# EAGLE design LESR_MainBoard (EAGLE 9.5.2)
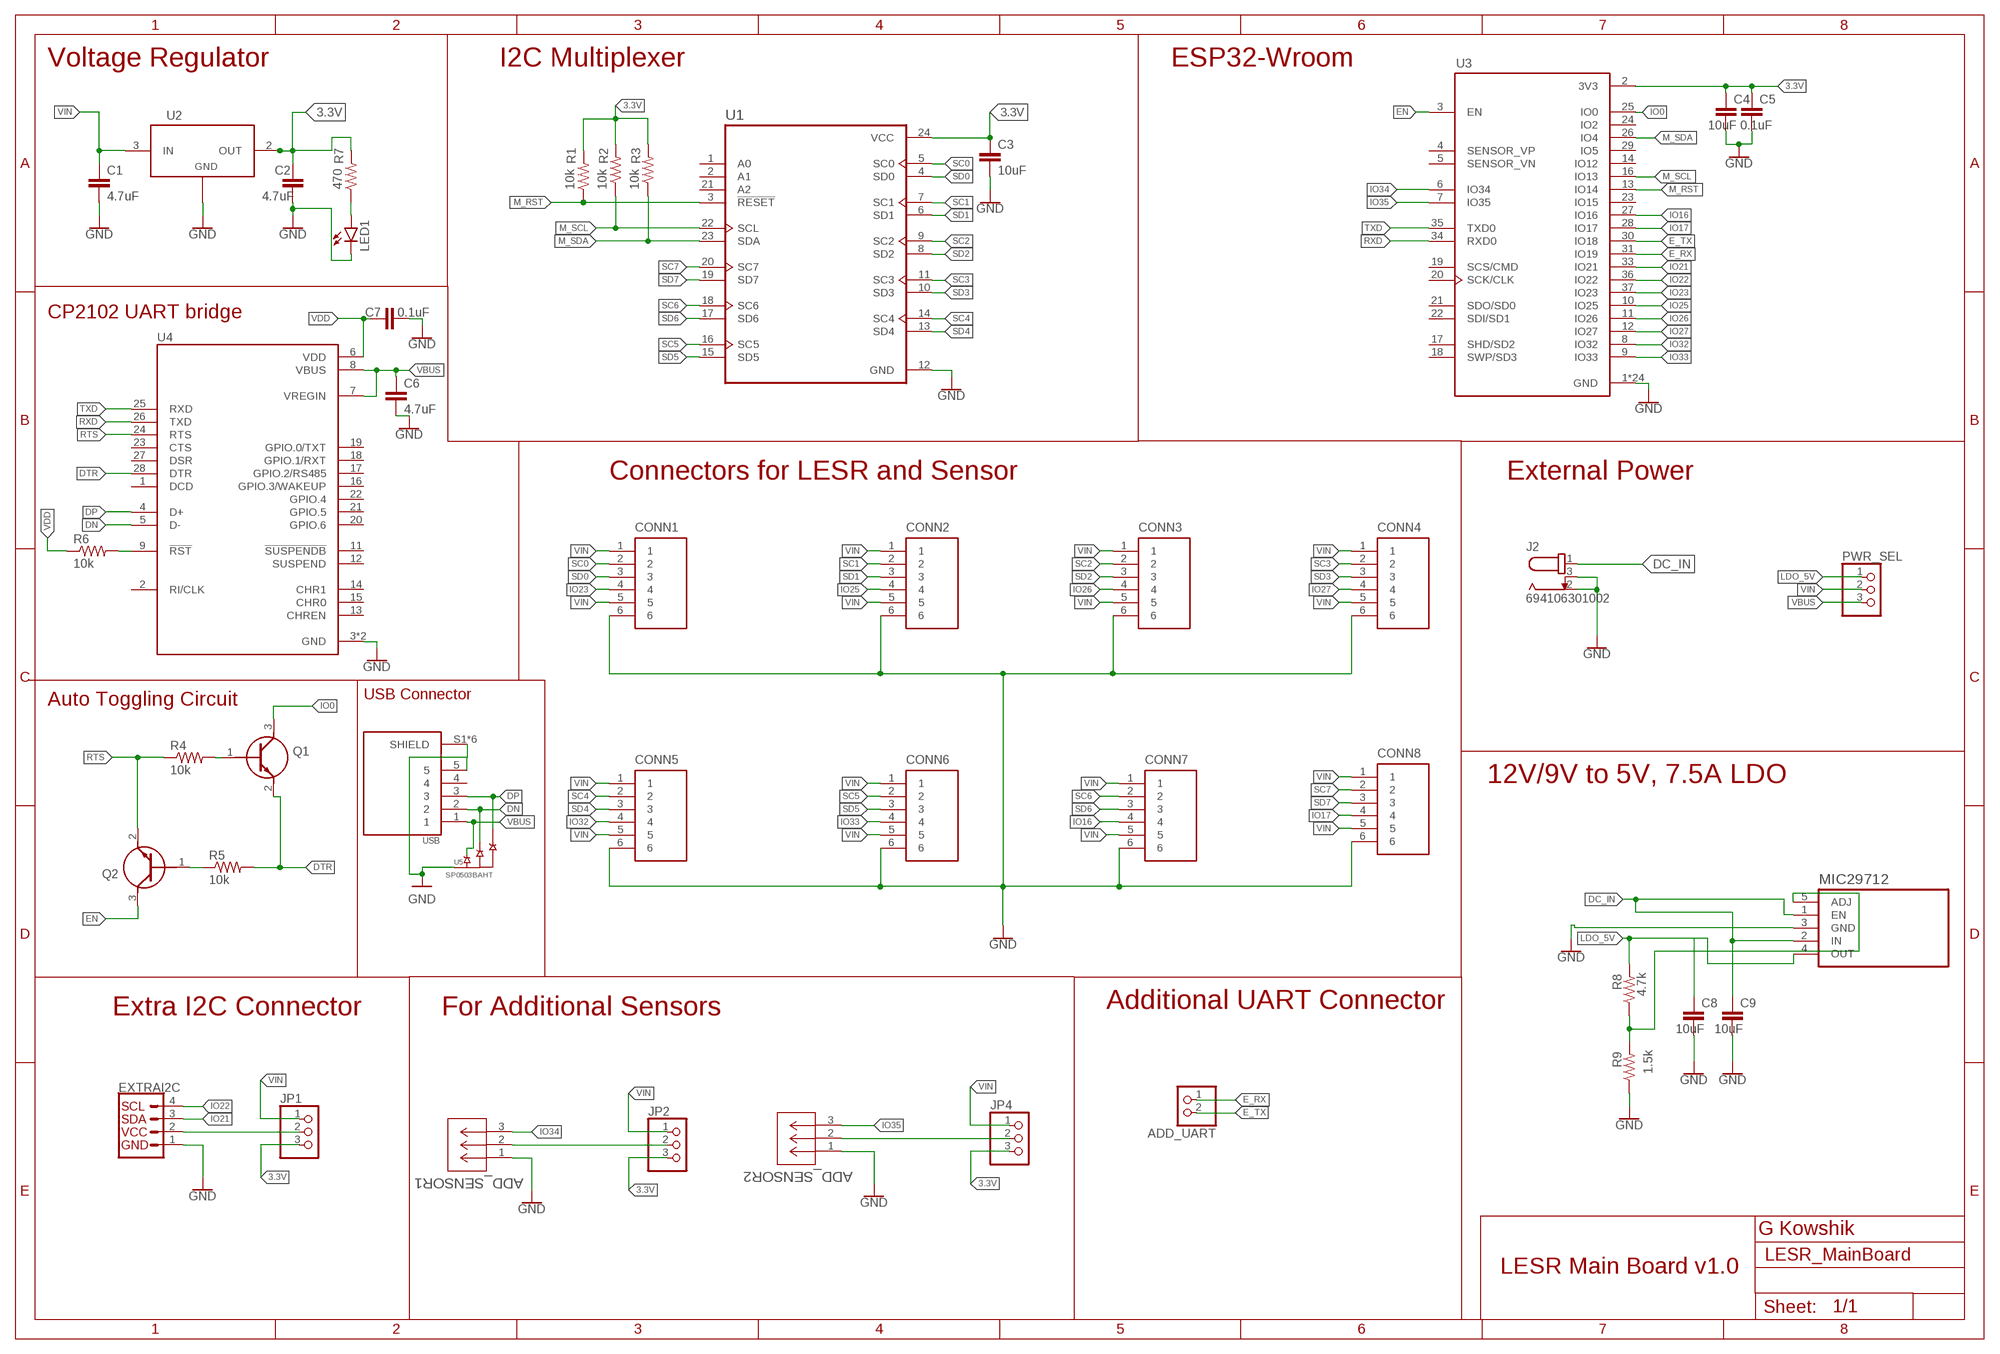
[diagram p0: schematic, sheet 1]

## Parts
ADD_SENSOR1  BM03B-SRSS-TB(LF)(SN)  [CONN_BM03B-SRSS-TB(LF)(SN)_JST]
ADD_SENSOR2  BM03B-SRSS-TB(LF)(SN)  [CONN_BM03B-SRSS-TB(LF)(SN)_JST]
ADD_UART  JST_2PIN-SMT  [JST-PH-2-SMT]
C1  4.7uF  C-EUC0805  [C0805]
C2  4.7uF  C-EUC0805  [C0805]
C3  10uF  C-EUC0805  [C0805]
C4  10uF  C-EUC0805  [C0805]
C5  0.1uF  C-EUC0805  [C0805]
C6  4.7uF  C-EUC0805  [C0805]
C7  0.1uF  C-EUC0805  [C0805]
C8  10uF  C-EUC0805  [C0805]
C9  10uF  C-EUC0805  [C0805]
CONN1  JST_6_PIN_VERTICAL  [JST-6-SMD-VERT-1.0MM]
CONN2  JST_6_PIN_VERTICAL  [JST-6-SMD-VERT-1.0MM]
CONN3  JST_6_PIN_VERTICAL  [JST-6-SMD-VERT-1.0MM]
CONN4  JST_6_PIN_VERTICAL  [JST-6-SMD-VERT-1.0MM]
CONN5  JST_6_PIN_VERTICAL  [JST-6-SMD-VERT-1.0MM]
CONN6  JST_6_PIN_VERTICAL  [JST-6-SMD-VERT-1.0MM]
CONN7  JST_6_PIN_VERTICAL  [JST-6-SMD-VERT-1.0MM]
CONN8  JST_6_PIN_VERTICAL  [JST-6-SMD-VERT-1.0MM]
EXTRAI2C  Vertical Qwiic Connector  QWIIC_CONNECTOR  [JST04_1MM_VERT]
J2  694106301002  [694106301002]
JP1  PINHD-1X3  [1X03]
JP2  PINHD-1X3  [1X03]
JP4  PINHD-1X3  [1X03]
LED1  LEDCHIPLED_0805  [CHIPLED_0805]
MIC29712  MIC29712WT  [TO170P1066X482X1572-5]
PWR_SEL  PINHD-1X3  [1X03]
Q1  SS8050-G  [SOT95P240X115-3N]
Q2  SS8050-G  [SOT95P240X115-3N]
R1  10k  R-US_R0805  [R0805]
R2  10k  R-US_R0805  [R0805]
R3  10k  R-US_R0805  [R0805]
R4  10k  R-US_R0805  [R0805]
R5  10k  R-US_R0805  [R0805]
R6  10k  R-US_R0805  [R0805]
R7  470  R-US_R0805  [R0805]
R8  4.7k  R-US_R0805  [R0805]
R9  1.5k  R-US_R0805  [R0805]
U1  TCA9548APWR  [SOP65P640X120-24N]
U2  NCP1117ST33T3G  [SOT-223]
U3  ESP32-WROOM-32  [MODULE_ESP32-WROOM-32]
U4  CP2102N-A01-GQFN28  [QFN50P500X500X80-29N]
U5  SP0503BAHT  [SOT143]
USB  10118194-0001LF  [AMPHENOL_10118194-0001LF]

## Nets
3.3V: C2.1 C3.1 C4.1 C5.1 JP1.3 JP2.3 JP4.3 R1.2 R2.2 R3.2 R7.2 U1.24(VCC) U2.2(OUT) U2.4 U3.2(3V3)
DC_IN: C9.1 J2.1 MIC29712.1(EN) MIC29712.2(IN)
DN: U4.5(D-) U5.3(B) USB.2
DP: U4.4(D+) U5.4(C) USB.3
DTR: Q1.2(E) R5.2 U4.28(DTR)
E_RX: ADD_UART.1 U3.31(IO19)
E_TX: ADD_UART.2 U3.30(IO18)
EN: Q2.3(C) U3.3(EN)
GND: ADD_SENSOR1.1 ADD_SENSOR2.1 C1.2 C2.2 C3.2 C4.2 C5.2 C6.2 C7.2 C8.2 C9.2 CONN1.6 CONN2.6 CONN3.6 CONN4.6 CONN5.6 CONN6.6 CONN7.6 CONN8.6 EXTRAI2C.1 J2.2 J2.3 LED1.C MIC29712.3(GND) R9.1 U1.12(GND) U2.1(ADJ/GND) U3.1(GND) U3.15(GND) U3.38(GND) U3.39_1(GND) U3.39_2(GND) U3.39_3(GND) U3.39_4(GND) U3.39_5(GND) U3.39_6(GND) U3.39_7(GND) U3.39_8(GND) U3.39_9(GND) U3.39_10(GND) U3.39_11(GND) U3.39_12(GND) U3.39_13(GND) U3.39_14(GND) U3.39_15(GND) U3.39_16(GND) U3.39_17(GND) U3.39_18(GND) U3.39_19(GND) U3.39_20(GND) U3.39_21(GND) U4.3(GND) U4.29(GND) U5.1(GND) USB.5 USB.S1(SHIELD) USB.S2(SHIELD) USB.S3(SHIELD) USB.S4(SHIELD) USB.S5(SHIELD) USB.S6(SHIELD)
IO0: Q1.3(C) U3.25(IO0)
IO16: CONN7.4 U3.27(IO16)
IO17: CONN8.4 U3.28(IO17)
IO21: EXTRAI2C.3 U3.33(IO21)
IO22: EXTRAI2C.4 U3.36(IO22)
IO23: CONN1.4 U3.37(IO23)
IO25: CONN2.4 U3.10(IO25)
IO26: CONN3.4 U3.11(IO26)
IO27: CONN4.4 U3.12(IO27)
IO32: CONN5.4 U3.8(IO32)
IO33: CONN6.4 U3.9(IO33)
IO34: ADD_SENSOR1.3 U3.6(IO34)
IO35: ADD_SENSOR2.3 U3.7(IO35)
LDO_5V: C8.1 MIC29712.4(OUT) PWR_SEL.1 R8.2
M_RST: R1.1 U1.3(!RESET) U3.13(IO14)
M_SCL: R2.1 U1.22(SCL) U3.16(IO13)
M_SDA: R3.1 U1.23(SDA) U3.26(IO4)
N$1: ADD_SENSOR1.2 JP2.2
N$2: MIC29712.5(ADJ) R8.1 R9.2
N$3: Q1.1(B) R4.2
N$4: Q2.1(B) R5.1
N$5: ADD_SENSOR2.2 JP4.2
N$6: R6.2 U4.9(!RST)
N$7: EXTRAI2C.2 JP1.2
N$8: LED1.A R7.1
RTS: Q2.2(E) R4.1 U4.24(RTS)
RXD: U3.34(RXD0) U4.26(TXD)
SC0: CONN1.2 U1.5(SC0)
SC1: CONN2.2 U1.7(SC1)
SC2: CONN3.2 U1.9(SC2)
SC3: CONN4.2 U1.11(SC3)
SC4: CONN5.2 U1.14(SC4)
SC5: CONN6.2 U1.16(SC5)
SC6: CONN7.2 U1.18(SC6)
SC7: CONN8.2 U1.20(SC7)
SD0: CONN1.3 U1.4(SD0)
SD1: CONN2.3 U1.6(SD1)
SD2: CONN3.3 U1.8(SD2)
SD3: CONN4.3 U1.10(SD3)
SD4: CONN5.3 U1.13(SD4)
SD5: CONN6.3 U1.15(SD5)
SD6: CONN7.3 U1.17(SD6)
SD7: CONN8.3 U1.19(SD7)
TXD: U3.35(TXD0) U4.25(RXD)
VBUS: C6.1 PWR_SEL.3 U4.7(VREGIN) U4.8(VBUS) U5.2(A) USB.1
VDD: C7.1 R6.1 U4.6(VDD)
VIN: C1.1 CONN1.1 CONN1.5 CONN2.1 CONN2.5 CONN3.1 CONN3.5 CONN4.1 CONN4.5 CONN5.1 CONN5.5 CONN6.1 CONN6.5 CONN7.1 CONN7.5 CONN8.1 CONN8.5 JP1.1 JP2.1 JP4.1 PWR_SEL.2 U2.3(IN)
Unconnected: U1.1(A0) U1.2(A1) U1.21(A2) U3.4(SENSOR_VP) U3.5(SENSOR_VN) U3.14(IO12) U3.17(SHD/SD2) U3.18(SWP/SD3) U3.19(SCS/CMD) U3.20(SCK/CLK) U3.21(SDO/SD0) U3.22(SDI/SD1) U3.23(IO15) U3.24(IO2) U3.29(IO5) U4.1(DCD) U4.2(RI/CLK) U4.11(!SUSPENDB) U4.12(SUSPEND) U4.13(CHREN) U4.14(CHR1) U4.15(CHR0) U4.16(GPIO.3/WAKEUP) U4.17(GPIO.2/RS485) U4.18(GPIO.1/RXT) U4.19(GPIO.0/TXT) U4.20(GPIO.6) U4.21(GPIO.5) U4.22(GPIO.4) U4.23(CTS) U4.27(DSR) USB.4

## Notes on the sheet
- Voltage Regulator | I2C Multiplexer | ESP32-Wroom
- CP2102 UART bridge
- Connectors for LESR and Sensor | External Power
- USB Connector
- Auto Toggling Circuit
- 12V/9V to 5V, 7.5A LDO
- Extra I2C Connector | For Additional Sensors | Additional UART Connector
- G Kowshik
- LESR Main Board v1.0

## Library data of the parts
ADD_SENSOR1 ADD_SENSOR2 = 3Pin_SMD_JST_Vertical:BM03B-SRSS-TB(LF)(SN); BUILT_BY: EMA_Cory; COPYRIGHT: Copyright (C) 2018 Accelerated Designs. All rights reserved; DATASHEET: http://www.jst-mfg.com/product/pdf/eng/eSR.pdf; MANUFACTURER_PART_NUMBER: BM03B-SRSS-TB(LF)(SN); SOURCELIBRARY: JST_2020-03-11; VENDOR: JST
ADD_UART = adafruit:JST_2PIN: JST 2-Pin Connectors of various flavors SMT-RA (S2B-PH-SM4) 4UConnector #17311 SMT (B2B-PH-SM4) THM-RA (S2B-PH) THM (B2B-PH)
C1-C9 = rcl:C-EU: CAPACITOR, European symbol; SPICEPREFIX: C
CONN1-CONN8 = SparkFun-Connectors:JST_6_PIN_VERTICAL: JST 6 pin vertical connector Here is a six pin vertical 1.0mm pitch connector. It is useful if you need something very tiny as a connection. These are not the standard JST type connectors we use on most of our boards, but are actually the much smaller JST-SH type. Here is the connector we sell at SparkFun: JST SH Vertical 6-Pin Connector - SMD <https://www.sparkfun.com/products/579> (GPS-00579) Datasheet <http://www.sparkfun.com/datasheets/GPS/EM406-SMDConnector-eSH.pdf> It was used on these SparkFun products: SparkFun GPS Breakout <https://www.sparkfun.com/products/11818> (BOB-11818) SparkFun Weather Shield <https://www.sparkfun.com/products/12081> (DEV-12081) And many, many other GPS related products.; PROD_ID: CONN-08249; SF_ID: GPS-00579
EXTRAI2C = SparkFun-Connectors:QWIIC_CONNECTOR: SparkFun I2C Standard Qwiic Connector An SMD 1mm pitch JST connector makes it easy and quick (get it? Qwiic?) to connect I2C devices to each other. The Qwiic system <http://www.sparkfun.com/qwiic> enables fast and solderless connection between popular platforms and various sensors and actuators. We carry 200mm <https://www.sparkfun.com/products/14204>, 100mm <https://www.sparkfun.com/products/14205>, 50mm <https://www.sparkfun.com/products/14206>, and breadboard friendly <https://www.sparkfun.com/products/14207> Qwiic cables. We also offer 10 pcs strips <https://www.sparkfun.com/products/14323> the SMD connectors.; PROD_ID: CONN-14483
J2 = DC Power Jacks:694106301002: CONN PWR JACK 2.1X5.5MM SOLDER Manufacturer's datasheet <https://katalog.we-online.de/em/datasheet/6941xx301002.pdf>; CREATED_BY: PCBLayout.com; DIGIKEY_PART_NUMBER: 732-5930-ND; MANUFACTURER: Wurth Electronics Inc.; MPN: 694106301002
JP1 JP2 JP4 PWR_SEL = adafruit:PINHD-1X3: PIN HEADER
LED1 = led:LED: LED OSRAM: - CHIPLED LG R971, LG N971, LY N971, LG Q971, LY Q971, LO R971, LY R971 LH N974, LH R974 LS Q976, LO Q976, LY Q976 LO Q996 - Hyper CHIPLED LW Q18S LB Q993, LB Q99A, LB R99A - SideLED LS A670, LO A670, LY A670, LG A670, LP A670 LB A673, LV A673, LT A673, LW A673 LH A674 LY A675 LS A676, LA A676, LO A676, LY A676, LW A676 LS A679, LY A679, LG A679 - Hyper Micro SIDELED® LS Y876, LA Y876, LO Y876, LY Y876 LT Y87S - SmartLED LW L88C, LW L88S LB L89C, LB L89S, LG L890 LS L89K, LO L89K, LY L89K LS L896, LA L896, LO L896, LY L896 - TOPLED LS T670, LO T670, LY T670, LG T670, LP T670 LSG T670, LSP T670, LSY T670, LOP T670, LYG T670 LG T671, LOG T671, LSG T671 LB T673, LV T673, LT T673, LW T673 LH T674 LS T676, LA T676, LO T676, LY T676, LB T676, LH T676, LSB T676, LW T676 LB T67C, LV T67C, LT T67C, LS T67K, LO T67K, LY T67K, LW E67C LS E67B, LA E67B, LO E67B, LY E67B, LB E67C, LV E67C, LT E67C LW T67C LS T679, LY T679, LG T679 LS T770, LO T770, LY T770, LG T770, LP T770 LB T773, LV T773, LT T773, LW T773 LH T774 LS E675, LA E675, LY E675, LS T675 LS T776, LA T776, LO T776, LY T776, LB T776 LHGB T686 LT T68C, LB T68C - Hyper Mini TOPLED® LB M676 - Mini TOPLED Santana® LG M470 LS M47K, LO M47K, LY M47K Source: http://www.osram.convergy.de LUXEON: - LUMILED® LXK2-PW12-R00, LXK2-PW12-S00, LXK2-PW14-U00, LXK2-PW14-V00 LXK2-PM12-R00, LXK2-PM12-S00, LXK2-PM14-U00 LXK2-PE12-Q00, LXK2-PE12-R00, LXK2-PE12-S00, LXK2-PE14-T00, LXK2-PE14-U00 LXK2-PB12-K00, LXK2-PB12-L00, LXK2-PB12-M00, LXK2-PB14-N00, LXK2-PB14-P00, LXK2-PB14-Q00 LXK2-PR12-L00, LXK2-PR12-M00, LXK2-PR14-Q00, LXK2-PR14-R00 LXK2-PD12-Q00, LXK2-PD12-R00, LXK2-PD12-S00 LXK2-PH12-R00, LXK2-PH12-S00 LXK2-PL12-P00, LXK2-PL12-Q00, LXK2-PL12-R00 Source: www.luxeon.com KINGBRIGHT: KA-3528ASYC Source: www.kingbright.com
MIC29712 = MIC29712WT:MIC29712WT: None; AVAILABILITY: Unavailable; DESCRIPTION: - Converter, Intel Pentium® Plus Voltage Regulator IC 1 Output TO-220-5; MF: Microchip; MP: MIC29712WT; PACKAGE: TO-220 Microchip; PRICE: None
Q1 Q2 = SS8050-G_NPN_transistor:SS8050-G: Bipolar Transistors - BJT NPN TRANSISTOR 1.5A 40V Source: Datasheet <http://www.comchiptech.com/admin/files/product/SS8050-G RevA181526.pdf>; AVAILABILITY: Unavailable; DESCRIPTION: Bipolar _BJT_ Transistor NPN 25V 1.5A 100MHz 300mW Surface Mount SOT-23; MF: Comchip Technology; MP: SS8050-G; PACKAGE: TO-236 Comchip; PRICE: None
R1-R9 = rcl:R-US_: RESISTOR, American symbol; SPICEPREFIX: R
U1 = TCA9548APWR_I2CMultiplexer:TCA9548APWR: Low-Voltage 8-Channel I2C Switch With Reset 24-TSSOP -40 to 85; AVAILABILITY: Unavailable; DESCRIPTION: IC I2C SW 8CH W/RESET 24TSSOP; DIGIKEY-PURCHASE-URL: https://snapeda.com/shop?store=DigiKey&id=280817; MF: Texas Instruments; MP: TCA9548APWR; PACKAGE: TSSOP-24 Texas Instruments; PRICE: None
U2 = IC:NCP1117ST33T3G: IC REG LINEAR 3.3V 1A SOT223 Manufacturer's datasheet <https://www.onsemi.com/pub/Collateral/NCP1117-D.PDF>; CREATED_BY: PCBLayout.com; DIGIKEY_PART_NUMBER: NCP1117ST33T3GOSTR-ND; MANUFACTURER: ON Semiconductor; MPN: NCP1117ST33T3G; PACKAGE: SOT-223
U3 = ESP32-WROOM-32:ESP32-WROOM-32: Bluetooth, WiFi Transceiver Module 2.4GHz ~ 2.5GHz Surface Mount; AVAILABILITY: Unavailable; DESCRIPTION: Bluetooth, WiFi 802.11b/g/n, Bluetooth v4.2 + EDR, Class 1, 2 and 3 Transceiver Module 2.4GHz ~ 2.5GHz Integrated, Trace Surface Mount; MF: Espressif Systems; MP: ESP32-WROOM-32; PACKAGE: Module Espressif Systems; PRICE: None
U4 = CP2102N-A01-GQFN28:CP2102N-A01-GQFN28: Ic Bridge Usb To Uart 28qfn; AVAILABILITY: Unavailable; DESCRIPTION: USB Bridge, USB to UART USB 2.0 UART Interface 28-QFN (5x5); MF: Silicon Labs; MP: CP2102N-A01-GQFN28; PACKAGE: QFN-28 Silicon Labs; PRICE: None
U5 = ESD_SP0503BAHT:SP0503BAHT; AVAILABILITY: Unavailable; DESCRIPTION: 8.5V Clamp Ipp Tvs Diode Surface Mount SOT-143-4; MF: Littelfuse Inc.; MP: SP0503BAHT; PACKAGE: SOT-143 Littelfuse; PRICE: None
USB = ThHole-USB-Micro-BType-receptacle:10118194-0001LF: Micro Usb, 2.0 Type b, Rcpt, Smt Buy Part <https://snapeda.com/parts/10118194-0001LF/Amphenol%20ICC%20%28FCI%29/view-part/?ref=eda>; AVAILABILITY: Good; DESCRIPTION: USB - micro B USB 2.0 Receptacle Connector 5 Position Surface Mount, Right Angle; Through Hole; DIGIKEY-PURCHASE-URL: https://snapeda.com/shop?store=DigiKey&id=4816633; MF: Amphenol ICC (FCI); MOUSER-PURCHASE-URL: https://snapeda.com/shop?store=Mouser&id=4816633; MP: 10118194-0001LF; PACKAGE: None; PRICE: None

## Board
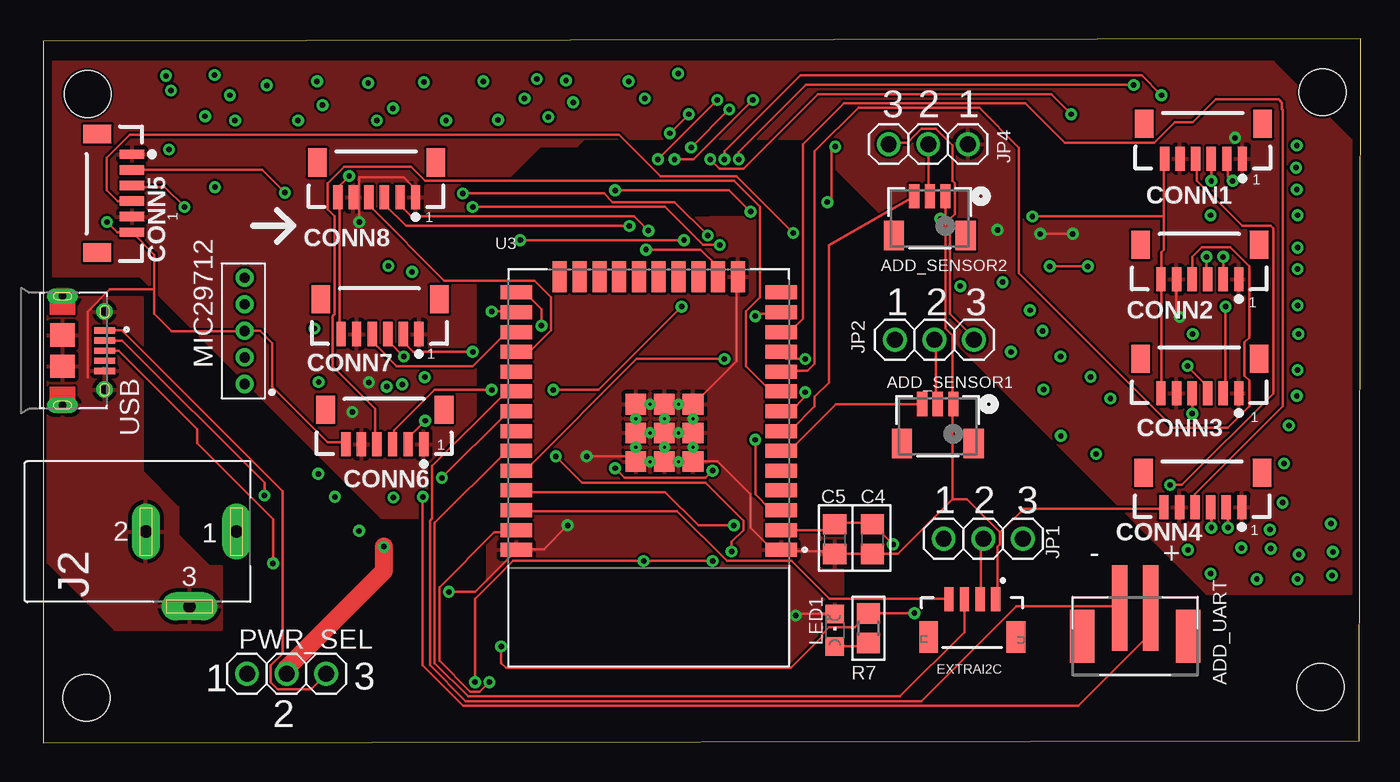
[diagram p1: board, top side]
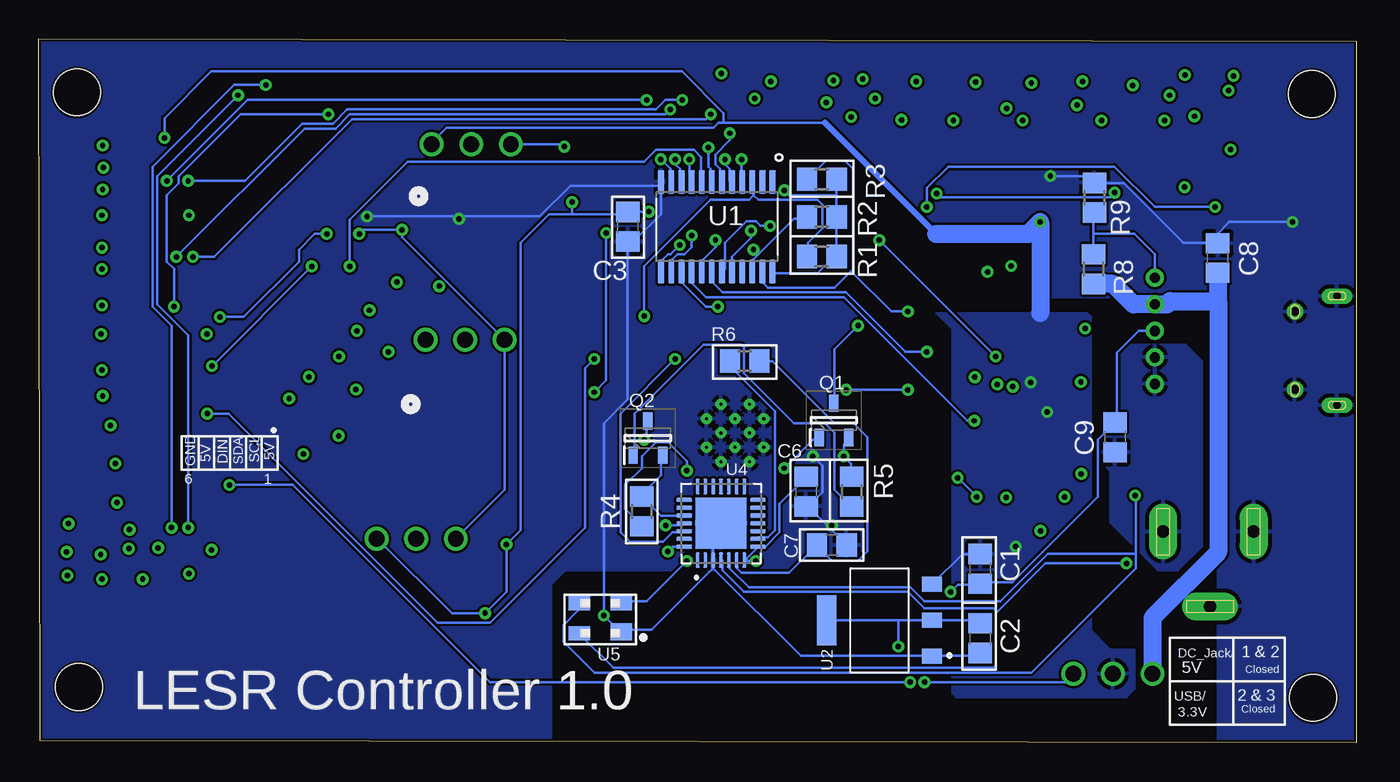
[diagram p2: board, bottom side, seen from below]

Size 84.51 x 45.14 mm. Coordinates in mm from the lower left corner, seen from the top.
Outline: 0,0 84.43,0.14 84.51,45.14 0,45 0,0
Copper layers (1*16): Top 0.035mm / dielectric 1.5mm / Bottom 0.035mm
Design rules "default *": minimum track width 6mil, minimum drill 0.35mm, track to track 6mil, track to pad 6mil, pad to pad 6mil, via to via 6mil, smd to smd 6mil, copper to edge 6mil, drill to drill 6mil, minimum pad ring 10mil, minimum via ring 8mil, stop-mask expansion 4mil, vias tented up to drill 0mil, thermal gap 10mil
Holes 3 mm at 2.84,41.62 82.06,41.72 81.93,3.57 2.76,2.88

### Footprints (pad centres in the part's own frame; a part is rotated, then mirrored left to right if it is on the bottom)
CONN_BM03B-SRSS-TB(LF)(SN)_JST = smd 0.66 x 1.549: 1 1,1.428; 2 0,1.428; 3 -1,1.428 | smd 1.295 x 1.905: 4 -2.3,-1.097; 5 2.3,-1.097
JST-PH-2-SMT = smd 1 x 5.5: 1 -1,-1.8; 2 1,-1.8 | smd 1.6 x 3.4: NC1 -3.4,0; NC2 3.4,0
C0805 = smd 1.3 x 1.5: 1 -0.95,0; 2 0.95,0
JST-6-SMD-VERT-1.0MM = smd 0.6 x 1.55: 1 -2.54,1.27; 2 -1.54,1.27; 3 -0.54,1.27; 4 0.46,1.27; 5 1.46,1.27; 6 2.46,1.27 | smd 1.2 x 1.8: P$1 -3.84,-0.955; P$2 3.76,-0.955
JST04_1MM_VERT = smd 0.6 x 1.55: 1 -1.478,0.775; 2 -0.478,0.775; 3 0.522,0.775; 4 1.522,0.775 | smd 1.2 x 2: NC1 -2.778,3.2; NC2 2.822,3.2
694106301002 = drill 0.8 pad 1.8 long: 1 13.6,0; 2 7.8,0; 3 10.6,-4.8
1X03 = drill 1.016: 1 -2.54,0; 2 0,0; 3 2.54,0
CHIPLED_0805 = smd 1.2 x 1.2: A 0,-1.05; C 0,1.05
TO170P1066X482X1572-5 = drill 0.66 pad 1.016: 1 0,0; 2 1.702,0; 3 3.404,0; 4 5.106,0; 5 6.808,0
SOT95P240X115-3N = smd 1.1 x 0.6: 1 -1.1,0.95; 2 -1.1,-0.95; 3 1.1,0
R0805 = smd 1.3 x 1.5: 1 -0.95,0; 2 0.95,0
SOP65P640X120-24N = smd 1.57 x 0.41: 1 -2.87,3.575; 2 -2.87,2.925; 3 -2.87,2.275; 4 -2.87,1.625; 5 -2.87,0.975; 6 -2.87,0.325; 7 -2.87,-0.325; 8 -2.87,-0.975; 9 -2.87,-1.625; 10 -2.87,-2.275; 11 -2.87,-2.925; 12 -2.87,-3.575; 13 2.87,-3.575; 14 2.87,-2.925; 15 2.87,-2.275; 16 2.87,-1.625; 17 2.87,-0.975; 18 2.87,-0.325; 19 2.87,0.325; 20 2.87,0.975; 21 2.87,1.625; 22 2.87,2.275; 23 2.87,2.925; 24 2.87,3.575
SOT-223 = smd 0.96 x 1.26: 1 -2.3,-3.375; 2 0,-3.375; 3 2.3,-3.375 | smd 3.19 x 1.26: 4 0,3.375
MODULE_ESP32-WROOM-32 = smd 2 x 0.9: 1 -8.5,5.26; 2 -8.5,3.99; 3 -8.5,2.72; 4 -8.5,1.45; 5 -8.5,0.18; 6 -8.5,-1.09; 7 -8.5,-2.36; 8 -8.5,-3.63; 9 -8.5,-4.9; 10 -8.5,-6.17; 11 -8.5,-7.44; 12 -8.5,-8.71; 13 -8.5,-9.98; 14 -8.5,-11.25; 25 8.5,-11.25; 26 8.5,-9.98; 27 8.5,-8.71; 28 8.5,-7.44; 29 8.5,-6.17; 30 8.5,-4.9; 31 8.5,-3.63; 32 8.5,-2.36; 33 8.5,-1.09; 34 8.5,0.18; 35 8.5,1.45; 36 8.5,2.72; 37 8.5,3.99; 38 8.5,5.26 | smd 0.9 x 2: 15 -5.715,-12.25; 16 -4.445,-12.25; 17 -3.175,-12.25; 18 -1.905,-12.25; 19 -0.635,-12.25; 20 0.635,-12.25; 21 1.905,-12.25; 22 3.175,-12.25; 23 4.445,-12.25; 24 5.715,-12.25 | smd 1.33 x 1.33: 39_1 -2.835,-0.405; 39_2 -1,-0.405; 39_3 0.835,-0.405; 39_4 -2.835,-2.24; 39_5 -1,-2.24; 39_6 0.835,-2.24; 39_7 -2.835,-4.075; 39_8 -1,-4.075; 39_9 0.835,-4.075 | drill 0.2 pad 0.3: 39_10 -1.917,-0.405; 39_11 -0.083,-0.405; 39_12 -2.835,-1.323; 39_13 -1,-1.323; 39_14 0.835,-1.323; 39_15 -1.917,-2.24; 39_16 -0.083,-2.24; 39_17 -2.835,-3.158; 39_18 -1,-3.158; 39_19 0.835,-3.158; 39_20 -1.917,-4.075; 39_21 -0.083,-4.075
QFN50P500X500X80-29N = smd 1.01 x 0.27: 1 -2.36,1.5; 2 -2.36,1; 3 -2.36,0.5; 4 -2.36,0; 5 -2.36,-0.5; 6 -2.36,-1; 7 -2.36,-1.5; 15 2.36,-1.5; 16 2.36,-1; 17 2.36,-0.5; 18 2.36,0; 19 2.36,0.5; 20 2.36,1; 21 2.36,1.5 | smd 0.27 x 1.01: 8 -1.5,-2.36; 9 -1,-2.36; 10 -0.5,-2.36; 11 0,-2.36; 12 0.5,-2.36; 13 1,-2.36; 14 1.5,-2.36; 22 1.5,2.36; 23 1,2.36; 24 0.5,2.36; 25 0,2.36; 26 -0.5,2.36; 27 -1,2.36; 28 -1.5,2.36 | smd 3.25 x 3.25: 29 0,0
SOT143 = smd 1.4 x 1.1: 1 -1.35,0.86 | smd 1.4 x 0.9: 2 -1.35,-0.96; 3 1.35,-0.96; 4 1.35,0.96
AMPHENOL_10118194-0001LF = smd 0.4 x 1.35: 1 -1.3,2.7; 2 -0.65,2.7; 3 0,2.7; 4 0.65,2.7; 5 1.3,2.7 | drill 0.55 pad 0.65: S1 -2.5,2.7; S2 2.5,2.7 | drill 0.5 pad 0.775 long: S3 -3.5,0; S6 3.5,0 | smd 1.5 x 1.55: S4 -1,0; S5 1,0

### Placement (x,y rotation side)
ADD_SENSOR1  57.38,20.29 0 top
ADD_SENSOR2  56.87,33.63 0 top
ADD_UART  70.04,6.83 180 top
C1  24.11,11.15 270 bottom
C2  24.11,6.71 270 bottom
C3  46.73,33.1 270 bottom
C4  53.19,13.06 270 top
C5  50.78,13.06 270 top
C6  35.28,16.1 270 bottom
C7  33.63,12.67 0 bottom
C8  8.88,31.09 90 bottom
C9  15.46,19.58 90 bottom
CONN1  74.39,38.73 180 top
CONN2  74.16,30.99 180 top
CONN3  74.16,23.69 180 top
CONN4  74.35,16.37 180 top
CONN5  4.41,35.2 270 top
CONN6  21.86,20.41 180 top
CONN7  21.56,27.48 180 top
CONN8  21.34,36.26 180 top
EXTRAI2C  59.62,9.98 180 top
J2  -1.23,13.54 0 top
JP1  60.3,13.08 0 top
JP2  57.17,25.84 0 top
JP4  56.77,38.39 180 top
LED1  50.78,7.21 0 top
MIC29712  12.91,23.01 90 top
PWR_SEL  15.6,4.42 0 top
Q1  33.51,20.68 90 bottom
Q2  45.44,19.53 90 bottom
R1  34.28,31.19 0 bottom
R2  34.28,33.73 0 bottom
R3  34.28,36.14 0 bottom
R4  45.82,14.83 270 bottom
R5  32.36,16.1 90 bottom
R6  39.22,24.49 180 bottom
R7  52.94,7.34 90 top
R8  16.84,30.38 270 bottom
R9  16.78,34.95 270 bottom
U1  41.01,33.1 270 bottom
U2  30.58,7.85 90 bottom
U3  38.84,17.63 180 top
U4  40.74,14.07 90 bottom
U5  48.49,7.98 180 bottom
USB  1.22,25.15 270 top

### Tracks (layer width: path | path; a pad name or v marks a point on that pad's centre or on a via)
3.3V  (via drill 0.35)
  Top 0.152: JP4.3 54.36,38.48 55.43,38.48 56.34,39.39 57.26,39.39 58.32,38.33 58.32,36.04 58.47,35.89 58.47,33.91 58.17,33.6 58.17,27.51 59.69,25.98 JP2.3 | v36.68,35.43 44,35.43 v45.37,34.06 | U3.2 47.35,13.64 50.4,13.64 50.7,13.94 C5.1 50.85,14.1 53.14,14.1 C4.1 53.29,13.94 v54.51,12.72 | v55.88,8.31 52.99,8.31 R7.2 52.84,8.15 52.07,7.39 50.4,7.39 49.94,6.93 49.94,6.78 47.96,4.8 29.67,4.8 29.37,5.1 v29.37,6.17 | v50.8,38.23 50.55,37.97 50.55,34.92 v50.3,34.67
  Bottom 0.152: 33.33,35.13 33.33,33.76 R2.2 33.33,33.6 33.33,31.32 R1.2 33.48,31.17 34.55,30.1 37.29,30.1 U1.24 | 33.33,35.13 33.33,36.04 R3.2 | 50.3,33.91 51.77,33.91 53.6,32.08 53.6,13.64 v54.51,12.72 54.51,9.68 v55.88,8.31 58.02,8.31 62.74,13.03 JP1.3 | 50.3,33.91 46.74,33.91 C3.1 46.59,34.06 v45.37,34.06 | 33.33,35.13 36.38,35.13 v36.68,35.43 | C2.1 24.18,7.7 24.34,7.85 U2.2 29.37,7.85 | U2.4 29.37,7.85 | v29.37,6.17 29.37,7.85 | JP4.3 50.97,38.39 v50.8,38.23 | v50.3,34.67 50.3,33.91
DC_IN
  pour Bottom: 10.93,25.53 15.24,25.53 16.51,24.26 16.51,18.16 15.75,17.4 15.75,14.1 12.7,11.05 11.43,11.05 9.91,12.57 9.91,24.51
DN  (via drill 0.35)
  Top 0.152: v14.18,15.85 14.18,16.66 5.04,25.8 USB.2
  Bottom 0.152: 14.13,12.12 19.76,12.12 22.81,9.07 27.69,9.07 28.6,9.98 38.97,9.98 40.19,11.2 40.19,11.66 U4.5 | v14.18,15.85 14.13,15.8 14.13,12.12 | 14.13,12.12 14.13,11.2 20.83,4.5 48.87,4.5 50.85,6.48 50.85,7.54 49.94,8.46 49.94,8.91 U5.3
DP  (via drill 0.35)
  Top 0.152: v14.74,11.51 14.74,14.33 9.86,19.2 9.86,20.12 4.83,25.15 USB.3
  Bottom 0.152: 23.12,8.31 23.12,4.95 23.27,4.8 47.65,4.8 49.79,6.93 U5.4 | 23.12,8.31 23.12,8.46 23.27,8.61 27.69,8.61 28.76,9.68 39.27,9.68 40.64,11.05 40.64,11.66 U4.4 | v14.74,11.51 19.92,11.51 23.12,8.31
DTR  (via drill 0.35)
  Top 0.152: v44.15,12.27 44.15,12.88 44.91,13.64 44.91,14.25 42.47,16.69 34.55,16.69 v32.87,18.36
  Bottom 0.152: v44.15,12.27 43.84,12.57 43.23,12.57 U4.28 | Q1.2 32.57,19.43 32.87,19.13 v32.87,18.36 32.41,17.91 32.41,17.14 R5.2
E_RX  (via drill 0.35)
  Top 0.152: v25.56,16.99 29.67,21.11 30.28,21.11 U3.31 | v24.34,15.77 24.34,4.95 26.93,2.36 66.4,2.36 70.97,6.93 70.97,8.61 ADD_UART.1
  Bottom 0.152: v24.34,15.77 v25.56,16.99
E_TX
  Top 0.152: U3.30 30.28,22.48 29.67,22.48 24.95,17.75 24.95,14.4 24.79,14.25 24.79,4.95 27.08,2.67 56.34,2.67 62.44,8.76 68.99,8.76 ADD_UART.2
EN  (via drill 0.35)
  Top 0.152: v45.67,19.43 45.67,15.93 46.59,15.01 47.2,15.01 U3.3
  Bottom 0.152: v45.67,19.43 45.52,19.58 45.52,20.5 Q2.3
GND  (via drill 0.35)
  Top 0.152: CONN3.6 71.73,22.48 71.73,29.64 CONN2.6 71.73,29.79 71.73,31.47 71.89,31.62 71.89,33.76 | 71.89,33.76 71.89,37.41 CONN1.6 | v63.45,33.76 71.89,33.76 | CONN6.6 19.31,19.28 18.24,19.28 14.68,22.83 14.68,25.63 13.9,26.42 MIC29712.3 12.88,26.39 8.23,26.39 7.12,27.51 7.12,29.08 | CONN7.6 19,26.29 19,34.98 CONN8.6 19,35.13 19,35.74 v19.61,36.35 | v33.63,13.94 32.11,12.42 30.43,12.42 U3.38 30.28,12.27 27.69,9.68 v26.01,9.68 | 41.71,18.06 41.71,18.82 U3.39_12 | 39.88,19.89 39.88,20.65 U3.39_18 | 39.88,18.06 39.88,18.82 U3.39_13 | 38.05,18.36 38.05,18.82 U3.39_14 38.05,18.97 38.05,19.74 U3.39_6 38.05,19.89 | 38.05,18.36 38.05,18.06 | 38.05,19.89 38.05,20.65 U3.39_19 | 38.05,18.06 38.81,18.06 U3.39_11 38.97,18.06 39.73,18.06 U3.39_2 39.88,18.06 | 38.05,18.06 U3.39_3 38.05,18.36 | 38.05,19.89 38.81,19.89 U3.39_16 38.97,19.89 39.73,19.89 U3.39_5 39.88,19.89 | 39.88,18.06 40.64,18.06 U3.39_10 40.8,18.06 41.56,18.06 U3.39_1 41.71,18.06 | 39.88,19.89 40.64,19.89 U3.39_15 40.8,19.89 41.56,19.89 U3.39_4 41.71,19.89 41.71,20.65 U3.39_17 41.71,20.8 41.71,21.56 U3.39_7 | U3.39_9 38.05,21.72 38.81,21.72 U3.39_21 38.97,21.72 39.73,21.72 U3.39_8 39.88,21.72 40.64,21.72 U3.39_20 40.8,21.72 41.56,21.72 U3.39_7 | U3.15 44.45,29.79 44.45,24.46 41.71,21.72 U3.39_7 | 38.05,18.36 v34.85,18.36 | 58.32,15.62 58.32,21.72 ADD_SENSOR1.1 58.32,21.87 58.32,26.14 57.86,26.59 57.86,33.6 | 58.32,15.62 54.82,12.12 53.29,12.12 C4.2 53.14,12.12 50.85,12.12 C5.2 50.7,12.12 50.55,12.27 47.35,12.27 U3.1 47.2,12.42 46.74,12.42 45.37,13.79 45.37,15.93 43.23,18.06 41.71,18.06 | 57.86,33.6 57.86,34.98 ADD_SENSOR2.1
  Top 0.152: 61.37,13.49 61.37,12.72 61.22,12.57 61.22,9.22 EXTRAI2C.1 | 61.37,13.49 59.24,15.62 58.32,15.62 | 61.37,13.49 62.89,15.01 71.89,15.01 CONN4.6 | 57.86,33.6 v57.56,33.6 | v48.26,8.15 48.37,8.26 LED1.C | 7.12,29.08 7.12,31.31 CONN5.6 4.72,32.74 v4.07,33.4 | 7.12,29.08 4.26,29.08 2.83,27.65 2.83,23.43 | USB.S2 3.61,22.65
  Bottom 0.152: 44.61,35.74 44.61,35.89 U1.12 | 44.61,35.74 44.61,33.91 46.28,32.23 46.59,32.23 C3.2 46.74,32.08 46.74,22.02 48.26,20.5 v48.26,8.15 47.2,7.09 U5.1 47.04,7.24 45.22,7.24 41.25,11.2 | C2.2 24.18,5.71 24.34,5.56 27.08,5.56 U2.1 27.23,5.56 35.61,5.56 41.25,11.2 | U4.29 40.8,13.94 41.25,13.49 41.25,11.81 U4.3 41.25,11.66 41.25,11.2 | 57.56,33.76 52.38,33.76 50.4,35.74 44.61,35.74 | 57.56,33.76 v63.45,33.76 | v19.61,36.35 17.17,36.35 16.87,36.04 R9.1 16.72,35.89 14.89,35.89 11.08,32.08 8.94,32.08 C8.2 8.88,32.65 8.13,33.4 v4.07,33.4 | 35.16,15.16 33.79,13.79 | 33.79,13.79 32.72,12.72 C7.2 | 33.79,13.79 v33.63,13.94 | 35.16,15.16 34.24,16.08 34.24,17.75 v34.85,18.36 | 35.16,15.16 C6.2 | v26.01,9.68 25.56,10.13 24.18,10.13 C1.2 24.03,10.29 22.05,10.29 16.56,15.77 16.56,19.43 15.5,20.5 C9.2 15.35,20.65 15.35,25 13.93,26.42 MIC29712.3 | v57.56,33.6 57.56,33.76
  pour Top: 51.31,33.8 51.31,-1.91 28.45,-1.91 28.45,33.55
  pour Bottom: 9.27,-2.08 8.87,-1.68 8.87,27.13 10.32,28.57 27.26,28.57 27.26,12.19 28.4,11.05 50.73,11.05 51.64,10.13 51.64,0.1 51.46,-0.08 85.93,-0.08 85.93,45.19 85.22,45.9 -1.06,45.9 -2.54,44.42 -2.54,0.2 -0.2,-2.13 9.27,-2.13
  pour Top: 10.67,11.3 11.43,11.3 11.43,7.24 4.58,7.24 0.26,11.56 0.26,28.57 6.35,28.57 6.35,17.4 8.64,15.11 8.64,13.33
IO0  (via drill 0.35)
  Top 0.152: v31.96,26.75 31.96,27.81 31.04,28.73 30.43,28.73 U3.25
  Bottom 0.152: v31.96,26.75 33.48,25.22 33.48,21.87 Q1.3
IO16
  Top 0.152: CONN7.4 21.14,26.14 21.14,25.68 22.66,24.15 27.54,24.15 29.67,26.29 30.28,26.29 U3.27
IO17
  Top 0.152: CONN8.4 20.98,34.98 20.98,34.37 25.71,29.64 31.5,29.64 32.57,28.57 32.57,26.44 31.19,25.07 30.43,25.07 U3.28
IO21
  Top 0.152: EXTRAI2C.3 59.08,9.07 59.08,7.09 54.97,2.97 27.23,2.97 25.1,5.1 25.1,14.1 29.67,18.67 30.28,18.67 U3.33
IO22
  Top 0.152: EXTRAI2C.4 58.02,9.22 50.45,9.22 48.01,11.66 43.84,11.66 40.64,14.86 30.43,14.86 U3.36
IO23  (via drill 0.35)
  Top 0.152: v72.29,16.53 73.05,16.53 78.9,22.38 78.9,32.99 78.74,33.15 76.91,33.15 74.02,36.04 74.02,37.41 CONN1.4 | v28.6,3.89 27.99,3.28 27.38,3.28 25.4,5.26 25.4,9.98 28.91,13.49 30.28,13.49 U3.37
  Bottom 0.152: v72.29,16.53 68.23,16.53 55.58,3.89 v28.6,3.89
IO25
  Top 0.152: CONN2.4 73.71,29.79 73.71,31.17 74.32,31.77 76.15,31.77 77.37,30.56 77.37,25.98 77.07,25.68 77.07,23.55 77.37,23.24 77.37,21.56 76,20.19 72.5,20.19 62.59,30.1 62.59,38.18 60.05,40.72 52.28,40.72 49.48,37.92 49.48,24.31 49.03,23.85 47.35,23.85 U3.10
IO26  (via drill 0.35)
  Top 0.152: v73.71,21.11 73.71,22.33 CONN3.4 | v48.87,24.61 47.65,24.61 47.35,24.92 U3.11
  Bottom 0.152: v73.71,21.11 72.34,21.11 58.93,7.7 55.58,7.7 49.48,13.79 49.48,24 v48.87,24.61
IO27
  Top 0.152: CONN4.4 73.89,15.95 79.51,21.56 79.51,40.61 79.47,40.64 79.47,41.06 79.25,41.27 75.23,41.27 73.76,39.8 72.6,39.8 71.28,38.48 65.54,38.48 63,41.02 51.36,41.02 48.72,38.38 48.72,27.2 47.96,26.44 47.35,26.44 U3.12
IO32  (via drill 0.35)
  Top 0.152: v48.11,32.69 44.45,36.35 39.58,36.35 36.94,38.99 5.53,38.99 4.07,37.53 4.07,35.43 4.76,34.74 CONN5.4 | v48.87,22.48 48.87,22.17 47.96,21.26 47.35,21.26 U3.8
  Bottom 0.152: v48.11,32.69 48.11,23.24 v48.87,22.48
IO33
  Top 0.152: CONN6.4 21.29,19.28 21.29,21.41 18.55,24.15 18.55,27.36 18.7,27.51 18.7,33.76 18.24,34.21 18.24,35.89 19.31,36.96 23.57,36.96 24.49,36.04 44.3,36.04 45.98,34.37 45.98,28.57 45.06,27.66 45.06,24.15 46.59,22.63 47.2,22.63 U3.9
IO34
  Top 0.152: ADD_SENSOR1.3 56.34,21.72 50.85,21.72 47.96,18.82 47.35,18.82 U3.6
IO35
  Top 0.152: ADD_SENSOR2.3 50.4,31.91 50.4,23.09 49.48,22.17 49.48,21.56 47.96,20.04 47.35,20.04 U3.7
LDO_5V
  Bottom 1.143: PWR_SEL.1 13.06,8 8.84,12.22 8.84,28.32 | R8.2 15.59,29.43 14.28,28.12 MIC29712.4 12.12,28.12 11.92,28.32 8.84,28.32 | 8.84,28.32 8.84,30.1 C8.1
M_RST  (via drill 0.35)
  Top 0.152: v45.67,27.36 45.83,27.51 47.2,27.51 U3.13
  Bottom 0.152: 38.66,35.13 38.36,34.82 34.55,34.82 34.24,34.52 34.24,32.99 35.16,32.08 35.16,31.32 R1.1 | 38.66,35.13 38.66,35.89 U1.3 | v45.67,27.36 45.67,30.56 41.41,34.82 38.97,34.82 38.66,35.13
M_SCL  (via drill 0.35)
  Top 0.152: v38.66,31.62 42.17,31.62 43.23,30.56 43.23,29.95 U3.16
  Bottom 0.152: 38.36,31.32 38.66,31.01 38.66,30.25 U1.22 | 38.36,31.32 36.07,33.6 35.31,33.6 R2.1 | 38.36,31.32 v38.66,31.62
M_SDA  (via drill 0.35)
  Top 0.152: v28.76,27.66 30.28,27.66 U3.26
  Bottom 0.152: 32.29,30.12 32.29,36.83 32.79,37.34 34.01,37.34 35.16,36.19 R3.1 | U1.23 38.05,30.1 38.05,29.49 37.75,29.18 33.48,29.18 32.41,30.25 32.29,30.12 | v28.76,27.66 29.82,27.66 32.29,30.12
N$1
  Top 0.152: ADD_SENSOR1.2 57.26,21.87 57.26,25.83 JP2.2
N$2
  Bottom 0.152: 16.87,32.64 16.87,31.47 R8.1 | 16.87,32.64 16.87,33.91 R9.2 | MIC29712.5 12.91,31.32 14.23,32.64 16.87,32.64
N$3  (via drill 0.35)
  Top 0.152: v36.68,17.6 37.29,16.99 42.47,16.99 v42.93,17.45
  Bottom 0.152: v36.68,17.6 34.85,19.43 34.55,19.43 Q1.1 | v42.93,17.45 42.93,18.06 44.15,19.28 44.91,19.28 45.83,18.36 45.83,17.6 46.89,16.53 46.89,15.01 45.83,13.94 R4.2
N$4
  Bottom 0.152: Q2.1 46.28,18.52 46.28,21.11 41.86,25.53 39.42,25.53 39.27,25.37 39.27,23.7 36.07,20.5 34.09,20.5 33.48,19.89 33.48,16.23 32.41,15.16 R5.1
N$5
  Top 0.152: ADD_SENSOR2.2 56.8,35.13 56.8,38.33 JP4.2
N$6
  Bottom 0.152: U4.9 38.36,13.18 37.75,13.18 37.29,13.64 37.29,21.26 40.03,24 40.03,24.46 R6.2
N$7
  Top 0.152: EXTRAI2C.2 60.15,9.22 60.15,12.88 60.3,13.03 JP1.2
N$8
  Top 0.152: LED1.A 50.85,6.17 52.68,6.17 52.84,6.32 R7.1
N$9  (via drill 0.35)
  other vias: 18.7,15.77
N$10  (via drill 0.35)
  other vias: 22.46,15.72
N$11  (via drill 0.35)
  other vias: 23.02,22.99
N$12  (via drill 0.35)
  other vias: 17.66,23.14
N$13  (via drill 0.35)
  other vias: 17.38,26.57
N$14  (via drill 0.35)
  other vias: 20.25,13.59
N$15  (via drill 0.35)
  other vias: 17.63,17.25
N$16  (via drill 0.35)
  other vias: 24.46,23.44
N$17  (via drill 0.35)
  other vias: 22.03,22.83
N$18  (via drill 0.35)
  other vias: 80.42,38.3
N$19  (via drill 0.35)
  other vias: 80.37,36.88
N$20  (via drill 0.35)
  other vias: 80.42,35.48
N$21  (via drill 0.35)
  other vias: 80.47,31.75
N$22  (via drill 0.35)
  other vias: 80.47,33.83
N$23  (via drill 0.35)
  other vias: 80.47,30.38
N$24  (via drill 0.35)
  other vias: 80.47,28.04
N$25  (via drill 0.35)
  other vias: 80.47,23.9
N$26  (via drill 0.35)
  other vias: 80.52,26.21
N$27  (via drill 0.35)
  other vias: 80.42,22.25
N$28  (via drill 0.35)
  other vias: 79.91,20.34
N$29  (via drill 0.35)
  other vias: 79.61,17.91
N$30  (via drill 0.35)
  other vias: 79.51,15.39
N$31  (via drill 0.35)
  other vias: 78.69,13.66
N$32  (via drill 0.35)
  other vias: 22.13,30.58
N$33  (via drill 0.35)
  other vias: 78.74,12.45
N$34  (via drill 0.35)
  other vias: 76.86,12.5
N$35  (via drill 0.35)
  other vias: 73.43,12.37
N$36  (via drill 0.35)
  other vias: 74.88,10.85
N$37  (via drill 0.35)
  other vias: 77.85,10.49
N$38  (via drill 0.35)
  other vias: 80.47,10.49
N$39  (via drill 0.35)
  other vias: 82.68,10.72
N$40  (via drill 0.35)
  other vias: 82.73,12.24
N$41  (via drill 0.35)
  other vias: 80.55,12.06
N$42  (via drill 0.35)
  other vias: 82.6,14.05
N$43  (via drill 0.35)
  other vias: 23.65,30.2
N$44  (via drill 0.35)
  other vias: 73.74,26.21
N$45  (via drill 0.35)
  other vias: 11,35.64
N$46  (via drill 0.35)
  other vias: 74.88,33.83
N$47  (via drill 0.35)
  other vias: 14.33,42.16
N$48  (via drill 0.35)
  other vias: 17.55,42.42
N$49  (via drill 0.35)
  other vias: 20.83,42.32
N$50  (via drill 0.35)
  other vias: 24.41,42.37
N$51  (via drill 0.35)
  other vias: 28.22,42.42
N$52  (via drill 0.35)
  other vias: 37.54,42.42
N$53  (via drill 0.35)
  other vias: 33.53,42.47
N$54  (via drill 0.35)
  other vias: 31.65,42.57
N$55  (via drill 0.35)
  other vias: 30.86,41.33
N$56  (via drill 0.35)
  other vias: 29.16,39.95
N$57  (via drill 0.35)
  other vias: 25.84,39.9
N$58  (via drill 0.35)
  other vias: 21.39,39.9
N$59  (via drill 0.35)
  other vias: 16.34,39.9
N$60  (via drill 0.35)
  other vias: 12.3,39.9
N$61  (via drill 0.35)
  other vias: 10.37,40.18
N$62  (via drill 0.35)
  other vias: 8.18,41.83
N$63  (via drill 0.35)
  other vias: 7.85,42.77
N$64  (via drill 0.35)
  other vias: 10.98,42.82
N$65  (via drill 0.35)
  other vias: 22.43,40.69
N$66  (via drill 0.35)
  other vias: 17.91,40.89
N$67  (via drill 0.35)
  other vias: 40.72,42.93
N$68  (via drill 0.35)
  other vias: 38.59,41.33
N$69  (via drill 0.35)
  other vias: 33.99,41.07
N$70  (via drill 0.35)
  other vias: 32.39,40.13
N$71  (via drill 0.35)
  other vias: 11.97,41.53
N$72  (via drill 0.35)
  other vias: 67.54,18.52
N$73  (via drill 0.35)
  other vias: 68.46,22.07
N$74  (via drill 0.35)
  other vias: 67.19,23.47
N$75  (via drill 0.35)
  other vias: 65.26,24.76
N$76  (via drill 0.35)
  other vias: 64.11,26.42
N$77  (via drill 0.35)
  other vias: 63.3,27.74
N$78  (via drill 0.35)
  other vias: 61.55,29.54
N$79  (via drill 0.35)
  other vias: 58.83,29.29
N$80  (via drill 0.35)
  other vias: 62.08,25.07
N$81  (via drill 0.35)
  other vias: 64.16,22.66
N$82  (via drill 0.35)
  other vias: 65.28,19.68
N$83  (via drill 0.35)
  other vias: 8.06,38.05
RTS
  Bottom 0.152: U4.24 43.23,14.55 44.61,14.55 R4.1 45.83,15.93 44.61,17.14 44.61,18.36 Q2.2
RXD  (via drill 0.35)
  Top 0.152: v43.69,24.61 38.05,24.61 30.89,17.45 30.43,17.45 U3.34
  Bottom 0.152: v43.69,24.61 47.2,21.11 47.2,13.49 46.59,12.88 44.45,12.88 43.84,13.49 43.23,13.49 U4.26
SC0  (via drill 0.35)
  Top 0.152: v76.31,36.04 76,36.35 76,37.41 CONN1.2 | v45.52,41.22 41.71,37.41 v40.49,37.41
  Bottom 0.152: v76.31,36.04 71.12,41.22 v45.52,41.22 | v40.49,37.41 40.49,37.11 40.19,36.8 40.19,36.04 U1.5
SC1  (via drill 0.35)
  Top 0.152: v75.7,31.17 75.7,29.79 CONN2.2 | v41.56,38.18 v44,40.61
  Bottom 0.152: v75.7,31.17 67.47,39.39 65.48,39.39 64.57,40.31 44.3,40.31 v44,40.61 | v41.56,38.18 41.56,36.96 41.41,36.8 41.41,36.04 U1.7
SC2  (via drill 0.35)
  Top 0.152: v75.85,27.96 75.85,22.48 CONN3.2 | v65.94,40.31 64.67,41.58 49.69,41.58 44.91,36.8 43.39,36.8 v42.78,37.41
  Bottom 0.152: v75.85,27.96 75.85,30.4 76.31,30.86 76.31,35.13 75.54,35.89 75.54,36.35 71.58,40.31 v65.94,40.31 | v42.78,37.41 42.78,36.04 U1.9
SC3  (via drill 0.35)
  Top 0.152: v76,13.79 76,15.01 CONN4.2 | v69.96,42.19 48.92,42.19 44.61,37.87 v44.61,37.41
  Bottom 0.152: v76,13.79 76,26.75 77.22,27.96 77.22,36.96 71.99,42.19 v69.96,42.19 | v44.61,37.41 44,36.8 44,36.04 U1.11
SC4  (via drill 0.35)
  Top 0.152: v26.9,35.23 35.97,35.23 36.53,34.67 40.49,34.67 v42.62,32.54 | CONN5.2 5.69,36.75 14.02,36.75 v15.5,35.28
  Bottom 0.152: v26.9,35.23 26.9,35.15 26.72,34.98 15.8,34.98 v15.5,35.28 | v42.62,32.54 42.62,31.77 43.08,31.32 43.54,31.32 43.84,31.01 43.84,30.25 U1.14
SC5  (via drill 0.35)
  Top 0.152: v24.49,20.65 23.42,19.58 23.42,19.28 CONN6.2
  Bottom 0.152: v24.49,20.65 24.95,20.65 32.87,28.57 41.71,28.57 42.62,29.49 42.62,30.1 U1.16
SC6  (via drill 0.35)
  Top 0.152: v27.54,25.07 23.73,25.07 23.12,25.68 23.12,26.14 CONN7.2
  Bottom 0.152: v27.54,25.07 28.91,25.07 32.72,28.88 40.64,28.88 41.25,29.49 41.25,30.1 U1.18
SC7  (via drill 0.35)
  Top 0.152: v38.81,32.84 37.9,33.76 23.57,33.76 22.97,34.37 22.97,34.98 CONN8.2
  Bottom 0.152: v38.81,32.84 38.81,32.38 40.03,31.17 40.03,30.25 U1.20
SD0  (via drill 0.35)
  Top 0.152: v74.93,36.04 74.93,37.41 CONN1.3 | v39.42,37.41 v43.23,41.22
  Bottom 0.152: v74.93,36.04 71.28,36.04 67.62,39.7 65.64,39.7 64.72,40.61 44.91,40.61 44.3,41.22 v43.23,41.22 | v39.42,37.41 39.42,36.04 U1.4
SD1  (via drill 0.35)
  Top 0.152: v74.63,31.17 74.63,29.79 CONN2.3 | v40.19,39.09 v41.41,40.31
  Bottom 0.152: v74.63,31.17 73.26,31.17 64.42,40 41.71,40 v41.41,40.31 | v40.19,39.09 40.19,38.63 41.1,37.72 41.1,37.11 40.8,36.8 40.8,36.04 U1.6
SD2  (via drill 0.35)
  Top 0.152: v73.41,24.15 74.63,22.94 74.63,22.48 CONN3.3 | v64.57,30.56 v67.01,30.56
  Bottom 0.152: v67.01,30.56 v73.41,24.15 | v64.57,30.56 64.57,33.55 60.86,37.26 45.67,37.26 44.91,38.02 42.47,38.02 42.02,37.57 42.02,36.04 U1.8
SD3  (via drill 0.35)
  Top 0.152: v74.93,13.79 74.93,15.01 CONN4.3 | v71.73,41.53 70.46,42.8 48.57,42.8 43.69,37.92 v43.69,37.41
  Bottom 0.152: v74.93,13.79 74.93,26.14 76.91,28.12 76.91,36.35 v71.73,41.53 | v43.69,37.41 43.69,37.11 43.39,36.8 43.39,36.04 U1.10
SD4  (via drill 0.35)
  Top 0.152: v9.05,34.37 7.78,35.64 5.77,35.64 CONN5.3 | v27.54,34.37 39.88,34.37 42.32,31.93 v43.39,31.93
  Bottom 0.152: v9.05,34.37 12.91,34.37 15.5,36.96 26.17,36.96 27.54,35.58 v27.54,34.37 | v43.39,31.93 44,31.32 44.15,31.32 44.45,31.01 44.45,30.25 U1.13
SD5  (via drill 0.35)
  Top 0.152: v28.76,22.63 25.1,22.63 22.51,20.04 22.51,19.28 CONN6.3 | v32.72,22.63 35.61,22.63 v40.95,27.96
  Bottom 0.152: v32.72,22.63 v28.76,22.63 | v40.95,27.96 41.71,27.96 43.23,29.49 43.23,30.1 U1.15
SD6  (via drill 0.35)
  Top 0.152: v23.12,24.76 22.2,25.68 22.2,26.14 CONN7.3 | v41.1,32.23 v30.59,32.23
  Bottom 0.152: v30.59,32.23 v23.12,24.76 | v41.1,32.23 41.1,31.77 41.86,31.01 41.86,30.25 U1.17
SD7  (via drill 0.35)
  Top 0.152: v37.6,33.15 23.27,33.15 21.9,34.52 21.9,34.98 CONN8.3
  Bottom 0.152: v37.6,33.15 38.21,33.15 38.51,33.45 39.12,33.45 40.49,32.08 40.49,30.4 40.64,30.25 U1.19
TXD  (via drill 0.35)
  Top 0.152: v44.3,13.94 42.02,13.94 39.88,16.08 30.43,16.08 U3.35
  Bottom 0.152: v44.3,13.94 43.23,13.94 U4.25
VBUS  (via drill 0.35)
  Top 0.152: v42.93,11.66 v38.51,11.66 30.13,11.66 27.69,9.22 v27.69,3.89 | PWR_SEL.3 18.09,4.34 17.17,3.43 15.04,3.43 14.58,3.89 14.58,4.95 15.35,5.71 15.35,16.13 5.03,26.45 USB.1
  Bottom 0.152: 38.36,12.57 39.12,11.81 U4.7 39.12,11.66 v38.51,11.66 | v42.93,11.66 45.52,9.07 47.04,9.07 U5.2 | 38.36,12.57 37.9,12.57 36.99,13.49 36.99,15.32 35.31,16.99 C6.1 | 38.36,12.57 U4.8 | v27.69,3.89 18.7,3.89 18.24,4.34 PWR_SEL.3
VDD
  Bottom 0.152: U4.6 39.73,11.66 39.73,11.2 39.42,10.9 36.38,10.9 34.7,12.57 C7.1 34.55,12.57 33.63,11.66 31.96,11.66 31.35,12.27 31.35,19.58 32.26,20.5 33.48,20.5 37.44,24.46 38.21,24.46 R6.1
VIN  (via drill 0.35)
  Top 0.152: CONN2.5 72.7,27.51 v72.9,27.3 | v66.04,32.64 v63.96,32.64 | v20.26,33.4 20.26,36.26 23.12,36.26 23.75,35.62 23.75,34.99 CONN8.1
  Top 1.143: PWR_SEL.2 15.6,4.78 21.85,11.02 v21.85,12.57
  Bottom 0.152: JP1.1 54.63,16.22 JP2.1 61.22,32.44 v61.22,32.89 63.71,32.89 v63.96,32.64 | v72.9,27.3 71.38,27.3 67.82,30.86 67.82,31.62 66.81,32.64 v66.04,32.64 | 40.58,39.75 40.9,39.75 41.22,39.43 58.36,39.43 59.31,38.48 JP4.1 | 40.58,39.75 34.06,39.75 | 40.58,39.75 40.58,40.39 43.25,43.05 73.47,43.05 76.46,40.07 v76.46,38.8 | C1.1 25.26,12.1 U2.3
  Bottom 0.406: 34.06,39.75 26.95,32.64
  Bottom 1.143: 20.26,27.56 v20.26,33.4 21.02,32.64 26.95,32.64
  other vias: 19.82,21.21 20.88,23.11
  pour Top: 6.18,29.92 0.64,29.92 0.64,43.66 78.9,43.66 83.9,38.66 83.9,9.55 74.63,9.55 53.78,30.4 53.78,33.86 48.9,38.73 34.73,38.73 34.24,38.25 31.88,38.25 27.71,34.09 27.71,16.64 25.5,14.43 21.67,14.43
  pour Bottom: 14.74,2.92 25.66,2.92 25.91,3.17 25.91,26.54 26.93,27.56 17.28,27.56 17.02,27.3 17.02,7.24 15.75,5.97 14.23,5.97 14.23,3.43

### Text on the board
tPlace: 3 | 2 | 1 | 1 | 1 | 1 | 1 | 1 | 2 | 3 | 1 | 1 | 1 | 1 | 2 | 3 | 1 | 1 | 3 | 2
bPlace: 5V | SCL | DIN | 5V | 1 | SDA | GND | 6 | 1 & 2 | DC_Jack/ | Closed | 5V | LESR Controller 1.0 | Closed | 2 & 3 | USB/ | 3.3V